# Altium schematic sheet Schemtaic Sheet 4.SchDoc
size A4; SheetNumber: 2; SheetTotal: 3
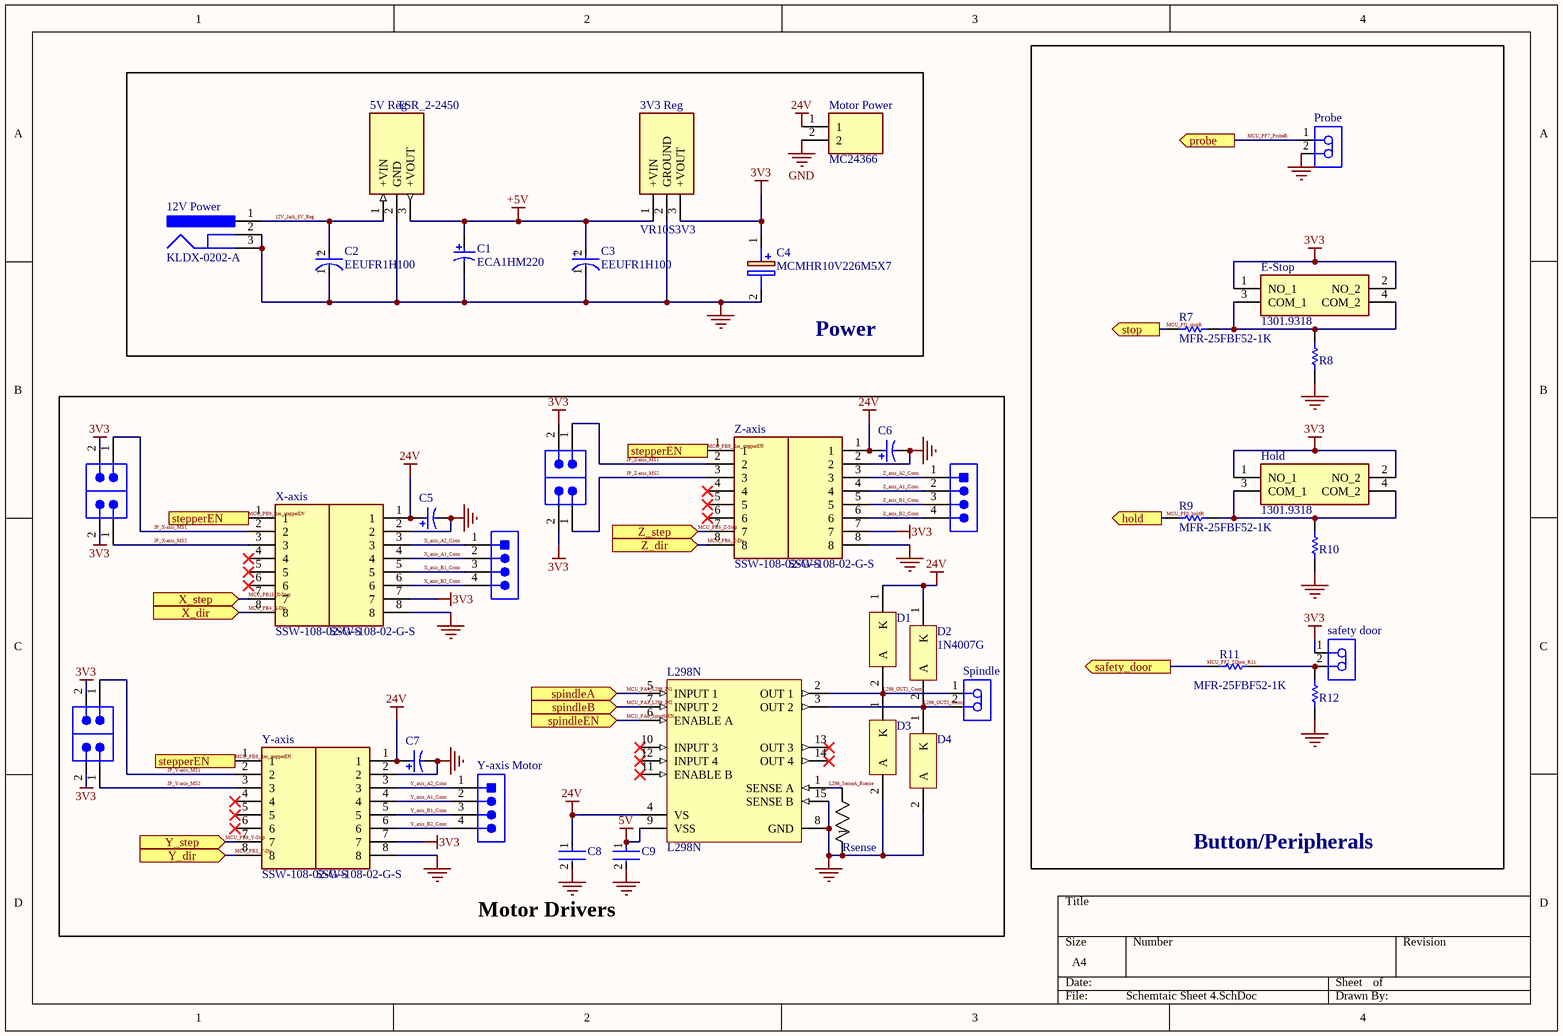
[diagram p0: Schemtaic Sheet 4.SchDoc]

## Parts
3V3_Reg  VR10S3V3  [VR10S3V3]
5V_Reg  TSR_2-2450  [TSR-2]
12V_Power  KLDX-0202-A  [KYCN-KLDX-0202-A_V]
C1  ECA1HM220  [CAPPR55-200-1100X500X1200]
C2  EEUFR1H100  [FP-RAD-TH-D_5_0_5-L_11_1-MFG]
C3  EEUFR1H100  [FP-RAD-TH-D_5_0_5-L_11_1-MFG]
C4  MCMHR10V226M5X7  [CAPPRD200W47D525H800]
C5  ECA1HM101  [CAPPR65-350-1150X800X1250]  (value not drawn)
C6  ECA1HM101  [CAPPR65-350-1150X800X1250]  (value not drawn)
C7  ECA1HM101  [CAPPR65-350-1150X800X1250]  (value not drawn)
C8  K104K15X7RF5TH5  [FP-K15H5-MFG]  (value not drawn)
C9  K104K15X7RF5TH5  [FP-K15H5-MFG]  (value not drawn)
D1  1N4007G  [ONSC-AXIAL_LEAD-2-59-10_P]  (value not drawn)
D2  1N4007G  [ONSC-AXIAL_LEAD-2-59-10_P]
D3  1N4007G  [ONSC-AXIAL_LEAD-2-59-10_P]  (value not drawn)
D4  1N4007G  [ONSC-AXIAL_LEAD-2-59-10_P]  (value not drawn)
E-Stop  1301.9318  [13019318]
Hold  1301.9318  [13019318]
L298N  L298N  [STM-FM-15]
Motor_Power  MC24366  [MC24366]
Probe  B2B-PH-K-S(LF)(SN)  [JST-B2B-PH-K-S_V]  (value not drawn)
R7  MFR-25FBF52-1K  [RESA60-630X240]
R8  MFR-25FBF5210K  [RESA60-630X240]  (value not drawn)
R9  MFR-25FBF52-1K  [RESA60-630X240]
R10  MFR-25FBF5210K  [RESA60-630X240]  (value not drawn)
R11  MFR-25FBF52-1K  [RESA60-630X240]
R12  MFR-25FBF5210K  [RESA60-630X240]  (value not drawn)
Rsense  AC05000001508JAC00  [RES_AC05_VIS]  (value not drawn)
safety_door  B2B-PH-K-S(LF)(SN)  [JST-B2B-PH-K-S_V]  (value not drawn)
Spindle  B2B-PH-K-S(LF)(SN)  [JST-B2B-PH-K-S_V]  (value not drawn)
X-axis  SSW-108-02-G-S  [RHDR8W79P0X254_1X8_2083X241X851P]
X-axis_Header_R  SSW-108-02-G-S  [RHDR8W79P0X254_1X8_2083X241X851P]
X-axis_Motor  B4B-EH-A(LF)(SN)  [JST-B4B-EH-A_V]  (value not drawn)
X-MS1  61300211121  [61300211121]  (value not drawn)
X-MS2  61300211121  [61300211121]  (value not drawn)
Y-axis  SSW-108-02-G-S  [RHDR8W79P0X254_1X8_2083X241X851P]
Y-axis_Header_R  SSW-108-02-G-S  [RHDR8W79P0X254_1X8_2083X241X851P]
Y-axis_Motor  B4B-EH-A(LF)(SN)  [JST-B4B-EH-A_V]  (value not drawn)
Y-MS1  61300211121  [61300211121]  (value not drawn)
Y-MS2  61300211121  [61300211121]  (value not drawn)
Z-axis  SSW-108-02-G-S  [RHDR8W79P0X254_1X8_2083X241X851P]
Z-axis_Header_R  SSW-108-02-G-S  [RHDR8W79P0X254_1X8_2083X241X851P]
Z-axis_Motor  B4B-EH-A(LF)(SN)  [JST-B4B-EH-A_V]  (value not drawn)
Z-MS1  61300211121  [61300211121]  (value not drawn)
Z-MS2  61300211121  [61300211121]  (value not drawn)

## Blocks framed on the sheet
Power: 3V3_Reg 5V_Reg 12V_Power C1-C4 Motor_Power
Button/Peripherals: E-Stop Hold Probe R7-R12 safety_door

## Ports
hold (out, see Schemtaic Sheet 2[2C]), probe (out, see Schemtaic Sheet 2[3C]), safety_door (out, see Schemtaic Sheet 2[2C]), spindleA (in, see Schemtaic Sheet 2[3B]), spindleB (in, see Schemtaic Sheet 2[2B]), spindleEN (in, see Schemtaic Sheet 2[3C]), stepperEN (out, see Schemtaic Sheet 2[4A], Schemtaic Sheet 4[1C]), stepperEN (out, see Schemtaic Sheet 2[4A], Schemtaic Sheet 4[1C], Schemtaic Sheet 4[2B]), stop (out, see Schemtaic Sheet 2[2C]), X_dir (in, see Schemtaic Sheet 2[3B]), X_step (in, see Schemtaic Sheet 2[3A]), Y_dir (in, see Schemtaic Sheet 2[3B]), Y_step (in, see Schemtaic Sheet 2[4A]), Z_dir (in, see Schemtaic Sheet 2[3C]), Z_step (in, see Schemtaic Sheet 2[3B])

## Nets
3V3: 3V3_Reg.3(+VOUT) C4.1(+) E-Stop.1(NO_1) E-Stop.2(NO_2) Hold.1(NO_1) Hold.2(NO_2) safety_door.1 X-axis_Header_R.7 X-MS1.2 X-MS2.2 Y-axis_Header_R.7 Y-MS1.2 Y-MS2.2 Z-axis_Header_R.7 Z-MS1.2 Z-MS2.2
5V: C9.1 L298N.9(VSS)
24V: C5.1 C6.1 C7.1 C8.1 D1.1(K) D2.1(K) L298N.4(VS) Motor_Power.1 X-axis_Header_R.1 Y-axis_Header_R.1 Z-axis_Header_R.1
+5V: 3V3_Reg.1(+VIN) 5V_Reg.3(+VOUT) C1.1 C3.2(A)
GND: 3V3_Reg.2(GROUND) 5V_Reg.2(GND) 12V_Power.2 12V_Power.3 C1.2 C2.1(C) C3.1(C) C4.2(-) C5.2 C6.2 C7.2 C8.2 C9.2 D3.2(A) D4.2(A) L298N.8(GND) L298N.15(SENSE_B) Motor_Power.2 Probe.2 R8.1 R10.1 R12.1 Rsense.1 X-axis_Header_R.2 X-axis_Header_R.8 Y-axis_Header_R.2 Y-axis_Header_R.8 Z-axis_Header_R.2 Z-axis_Header_R.8
12V_Jack_5V_Reg: 5V_Reg.1(+VIN) 12V_Power.1 C2.2(A)
JP_X-axis_MS1: X-axis.2 X-MS1.1
JP_X-axis_MS2: X-axis.3 X-MS2.1
JP_Y-axis_MS1: Y-axis.2 Y-MS1.1
JP_Y-axis_MS2: Y-axis.3 Y-MS2.1
JP_Z-axis_MS1: Z-axis.2 Z-MS1.1
JP_Z-axis_MS2: Z-axis.3 Z-MS2.1
L298_OUT1_Conn: D1.2(A) D3.1(K) L298N.2(OUT_1) Spindle.1
L298_OUT2_Conn: D2.2(A) D4.1(K) L298N.3(OUT_2) Spindle.2
L298_SenseA_Rsense: L298N.1(SENSE_A) Rsense.2
MCU_PA0_SpindleEN: L298N.6(ENABLE_A) ; port spindleEN
MCU_PA3_L298_IN2: L298N.7(INPUT_2) ; port spindleB
MCU_PA4_L298_IN1: L298N.5(INPUT_1) ; port spindleA
MCU_PB3_Y-Dir: Y-axis.8 ; port Y_dir
MCU_PB4_X-Dir: X-axis.8 ; port X_dir
MCU_PB5_Z-Step: Z-axis.7 ; port Z_step
MCU_PB6_Z-Dir: Z-axis.8 ; port Z_dir
MCU_PB8_Y-Step: Y-axis.7 ; port Y_step
MCU_PB9_Res_stepperEN: X-axis.1 Y-axis.1 Z-axis.1 ; port stepperEN
MCU_PB15_X-Step: X-axis.7 ; port X_step
MCU_PF0_holdR: R9.1 ; port hold
MCU_Pf1_stopR: R7.1 ; port stop
MCU_PF2_SDoor_R11: R11.1 ; port safety_door
MCU_PF7_ProbeR: Probe.1 ; port probe
X_axis_A1_Conn: X-axis_Header_R.4 X-axis_Motor.2
X_axis_A2_Conn: X-axis_Header_R.3 X-axis_Motor.1
X_axis_B1_Conn: X-axis_Header_R.5 X-axis_Motor.3
X_axis_B2_Conn: X-axis_Header_R.6 X-axis_Motor.4
Y_axis_A1_Conn: Y-axis_Header_R.4 Y-axis_Motor.2
Y_axis_A2_Conn: Y-axis_Header_R.3 Y-axis_Motor.1
Y_axis_B1_Conn: Y-axis_Header_R.5 Y-axis_Motor.3
Y_axis_B2_Conn: Y-axis_Header_R.6 Y-axis_Motor.4
Z_axis_A1_Conn: Z-axis_Header_R.4 Z-axis_Motor.2
Z_axis_A2_Conn: Z-axis_Header_R.3 Z-axis_Motor.1
Z_axis_B1_Conn: Z-axis_Header_R.5 Z-axis_Motor.3
Z_axis_B2_Conn: Z-axis_Header_R.6 Z-axis_Motor.4
NetE-Stop_3: E-Stop.3(COM_1) E-Stop.4(COM_2) R7.2 R8.2
NetHold_3: Hold.3(COM_1) Hold.4(COM_2) R9.2 R10.2
NetR11_2: R11.2 R12.2 safety_door.2

Not connected (* = marked no-connect by the designer): L298N 10(INPUT_3)* 11(ENABLE_B)* 12(INPUT_4)* 13(OUT_3)* 14(OUT_4)*; X-axis 4* 5* 6*; Y-axis 4* 5* 6*; Z-axis 4* 5* 6*

## Notes on the sheet
- Motor Drivers
- (in symbol CMP-05427-001295-1) +

## Library data of the parts
3V3_Reg = VR10S3V3: Power Supply; Manufacturer_Name: XP POWER; Datasheet Link: https://www.xppower.com/portals/0/pdfs/SF_VR10.pdf; Height: 10.9mm; Manufacturer_Part_Number: VR10S3V3; Mouser Part Number: 209-VR10S3V3; Mouser Price/Stock: https://www.mouser.co.uk/ProductDetail/XP-Power/VR10S3V3?qs=7MVldsJ5UazpqISEyvrTNQ%3D%3D
5V_Reg = TSR_2-2450: Power Supply; Manufacturer_Name: Traco Power; Manufacturer_Part_Number: TSR 2-2450; Datasheet Link: https://tracopower.com/tsr2-datasheet/; Mouser Part Number: 495-TSR2-2450; Mouser Price/Stock: https://www.mouser.co.uk/ProductDetail/TRACO-Power/TSR-2-2450?qs=NtE2QagKf6RzknAolzm%2FTQ%3D%3D; Arrow Part Number: TSR 2-2450; Arrow Price/Stock: https://www.arrow.com/en/products/tsr2-2450/traco-electronic-ag?region=europe
12V_Power = CMP-1673-00001-5: DC Power Jack, 24 V, 3.5 A, -25 to 85 degC, 3-Pin THD, RoHS; Manufacturer: Kycon; Voltage Rating: 24 V; Current Rating: 3.5 A; Height: 10.8 mm; Length: 9.2 mm; Pins: 2; Housing Material: PBT; Connector Type: Power; ComponentLink2URL: http://www.kycon.com/Pub_Eng_Draw/KLDX-0202-X.PDF; PackageDescription: 3-Pin Through Hole Device, Body 14.5 x 9 mm; Max Operating Temperature: 85 degC; Min Operating Temperature: -25 degC; PackageReference: KLDX-0202-A; Contact Gender: Female; Package Quantity: 500; Mount: Through Hole; Colour: Black; Contact Plating: Tin; DatasheetVersion: Rev. D3, 06/2013; ComponentLink2Description: Datasheet; RoHSCompliant: true; Mounting Technology: Through Hole; ComponentLink1Description: Manufacturer URL; Contact Material: Brass; ComponentLink1URL: http://www.kycon.com/
C1 = CMP-1665-00036-2: Aluminum Electrolytic Capacitor, 22 uF, +/- 20%, 50 V, -40 to 85 degC, 2-Pin THD, RoHS, Bulk; Manufacturer: Panasonic; Ripple Current: 100mA; Life (Hours): 2000Hour; Voltage: 50V; Dissipation Factor: 0.12%; Leakage Current: 3uA; Lead/Base Style: Straight; Capacitance: 22uF; Lead Diameter: 0.5mm; Max Operating Temperature: 85degC; Height: 11mm; Package Reference: CAPPR55-200-1100X500X1200; Radiation Hardening: No; RoHSCompliant: true; Termination: Radial; Case/Package: Radial; REACH SVHC: NoSVHC; Height - Seated (Max): 0.472inch; Min Operating Temperature: -40degC; Packaging: Bulk; Manufacturer URL: http://www.panasonic.com/; Length: 11mm; Tolerance: 20%; Voltage Rating: 50V; Voltage Rating (DC): 50V; Datasheet URL: https://industrial.panasonic.com/cdbs/www-data/pdf/RDF0000/ABA0000C1218.pdf; Lead Pitch: 2mm; Ripple Current (AC): 100mA; Package Description: 2-Pin Radial Lead, Dia 5 mm, Height 12 mm; Diameter: 5mm; Datasheet Version: Rev. 05, 10/2016; Package Quantity: 200; Mount: ThroughHole
C2 C3 = CMP-05427-001295-1: Aluminum Electrolytic Capacitors (Radial Lead Type) 10uF ±20% 50V; Lead Diameter: 0.5mm; Life (Hours): 5000Hour; Impedance: 340mR; Ripple Current (AC): 250mA; REACH SVHC: Yes; Tolerance: 20%; Construction: RADIAL; Min Operating Temperature: -40°C; Termination: Radial; Voltage Rating: 50V; Height: 11mm; Max Operating Temperature: 105°C; Capacitance: 10uF; Voltage: 50V; Diameter: 5mm; Lead Pitch: 2mm; Series: FR Radial; RoHS Compliant: Yes; Case/Package: Radial
C4 = MCMHR10V226M5X7: Capacitor Polarised; Manufacturer_Name: Multicomp Pro; Datasheet Link: https://componentsearchengine.com/Datasheets/2/MCMHR10V226M5X7.pdf; Height: 8mm; Manufacturer_Part_Number: MCMHR10V226M5X7
C5-C7 = CMP-1665-00042-2: Aluminum Electrolytic Capacitor, 100 uF, +/- 20%, 50 V, -40 to 85 degC, 2-Pin THD, RoHS, Bulk; Manufacturer: Panasonic; Lead Diameter: 0.6mm; Dielectric Material: Aluminium; Voltage Rating (DC): 50V; Ripple Current (AC): 250mA; Polarity: Polar; Leakage Current: 3uA; Capacitance: 100uF; Life (Hours): 2000Hour; Lead/Base Style: Straight; Dissipation Factor: 0.12%; Radiation Hardening: No; Height: 11.5mm; Package Quantity: 200; Package Reference: CAPPR65-350-1150X800X1250; Min Operating Temperature: -40degC; Mount: ThroughHole; Package Description: 2-Pin Radial Lead, Dia 8 mm, Height 12.5 mm; Case/Package: Radial; Diameter: 8mm; Voltage Rating: 50V; Length: 11.5mm; REACH SVHC: NoSVHC; Height - Seated (Max): 0.492inch; Datasheet URL: https://industrial.panasonic.com/cdbs/www-data/pdf/RDF0000/ABA0000C1218.pdf; RoHSCompliant: true; Ripple Current: 250mA; Lead Free: LeadFree; Voltage: 50V; Manufacturer URL: http://www.panasonic.com/; Number of Pins: 2; Datasheet Version: Rev. 05, 10/2016; Packaging: Bulk; Termination: Radial; Max Operating Temperature: 85degC; Tolerance: 20%; Lead Pitch: 3.5mm
C8 C9 = CMP-02417-000078-1: CAP CER 0.1UF 50V X7R RADIAL; Capacitance: 100nF; Tolerance: 10%; Dielectric Material: Ceramic; Lead Length: 30mm; Lead Diameter: 0.5mm; Lead/Base Style: Formed Leads; Diameter: 500um; Max Operating Temperature: 125°C; Case/Package: Dipped; Dielectric: X7R; Lead Free: Lead Free; Construction: RADIAL; Voltage: 50V; Thickness: 2.6mm; Min Operating Temperature: -55°C; Lead Pitch: 5mm; Height: 4mm; Radiation Hardening: No; Voltage Rating: 50V; Depth: 2.5mm; Voltage Rating (DC): 50V; Package Quantity: 1; Weight: 0.005644oz; Series: K; Mount: Through Hole; Termination: Radial; Height - Seated (Max): 0.257inch; Length: 4mm; Packaging: Tape and Reel; Width: 2.5mm; RoHS Compliant: Yes
D1-D4 = CMP-0902-00143-1: Standard Recovery Rectifier, 2-Pin Axial_Lead, Pb-Free, Bulk Bag; Manufacturer: On Semiconductor; VRRM Max (V): 1000; IFSM Max (A): 30; IO(rec) Max (A): 1; ComponentLink2Description: Datasheet; ComponentLink2URL: http://www.onsemi.com/pub_link/Collateral/1N4001-D.PDF; PackageDescription: 2-Pin, Axial Lead, Diameter 2.35 mm; PartNumber: 1N4007G; ComponentLink1URL: http://www.onsemi.com/; ComponentLink3URL: http://www.onsemi.cn/pub_link/Collateral/59-10.PDF; PackageReference: AXIAL_LEAD-2-59-10; ComponentLink1Description: Manufacturer URL; Mounting Technology: Through Hole; ComponentLink3Description: Package Specification; Packing: Bulk Bag; PackageVersion: Rev. U, 02/2005; DatasheetVersion: Rev. 13; RoHS: TRUE; Type: Standard Recovery
E-Stop Hold = 1301.9318: IP40 Black Button Tactile Switch, SPST-NO 4.4mm; Manufacturer_Name: SCHURTER; Geometry.Height: 8mm; Manufacturer_Part_Number: 1301.9318; Mouser Part Number: 693-1301.9318; Mouser Price/Stock: https://www.mouser.co.uk/ProductDetail/Schurter/13019318?qs=tGaZrb6HVSaxYojxkk2y5w%3D%3D; Arrow Part Number: *; Arrow Price/Stock: *; Datasheet Link: https://componentsearchengine.com/Datasheets/2/1301.9318.pdf
L298N = CMP-2000-06526-1: Dual Full-Bridge Driver, 4.8 to 46 V, -40 to 150 degC, 15-Pin FM (MW 15L), RoHS, Tube; Manufacturer: STMicroelectronics; PartNumber: L298; Output Current: 2A; Supply Voltage Max: 7V; Driver Case Style: Multiwatt; Supply Voltage Min: 4.5V; No. of Pins: 15Pins; SVHC: NoSVHC(17-Dec-2015); Output Voltage: 46V; No. of Outputs: 4Outputs; Motor Type: FullBridge; MSL: -; Package Description: 15-Pin Flange Mount, Body 5 x 19.6 mm, Pitch 1.27 mm; Datasheet Version: 01/2000; Package Reference: FM-15; Mounting Technology: ThroughHole; Packaging: Each; Automotive Qualification Standard: -; Product Range: -; Datasheet URL: https://datasheet.ciiva.com/15109/getdatasheetpartid-50682-15109332.pdf; Operating Temperature Max: 130°C; Operating Temperature Min: -25°C; Manufacturer URL: http://www.st.com/
Motor_Power = MC24366: TERMINAL BLOCK, WIRE TO BRD, 2POS, 12AWG; Manufacturer_Name: MULTICOMP; Geometry.Height: 14.3mm; Manufacturer_Part_Number: MC24366; Mouser Part Number: *; Mouser Price/Stock: *; Arrow Part Number: *; Arrow Price/Stock: *; Datasheet Link: *
Probe safety_door Spindle = CMP-2000-05162-1: Male Header, Pitch 2 mm, 1 x 2 Position, Height 6 mm, Tail Length 3.4 mm, -25 to 85 degC, RoHS, Bulk; Manufacturer: JST; Pitch: 2mm; Style/Orientation: StraightHeader/Plug; No of Positions: 2; Datasheet Version: Nov-08; Datasheet URL: http://datasheet.octopart.com/B2B-PH-K-S%28LF%29%28SN%29-JST-datasheet-8324864.pdf; Manufacturer URL: http://www.jst.com/home2.html; Type: ShroudedHeader; Termination: Crimp
R7 R9 R11 = CMP-1659-00075-1: Axial Resistor, 1 KOhm, +/- 1%, 250 mW, -55 to 155 degC, 2-Pin THD, RoHS, Bulk; Voltage Rating: 250 V; Resistance: 10 kohm; Power Rating: 250 mW; ComponentLink2Description: Datasheet; RoHSCompliant: true; PackageReference: MFR-25; Case\Package: Axial; Max Operating Temperature: 155 degC; DatasheetVersion: Apr-13; Tolerance: 1%; ComponentLink1URL: http://www.yageo.com/; Length: 0.248 inch; ComponentLink2URL: http://www.yageo.com/documents/recent/Yageo%20LR_MFR_2013.pdf; Packaging: Bulk; Package Quantity: 200; PackageDescription: 2-Pin Axial Lead, Dia 2.4 mm, Body Length 6.3 mm; Min Operating Temperature: -55 degC; ComponentLink1Description: Manufacturer URL
R8 R10 R12 = CMP-1659-00074-2: Axial Resistor, 10 KOhm, +/- 1%, 0.25 W, -55 to 155 degC, 2-Pin THD, RoHS, Bulk; Manufacturer: Yageo; Temperature Coefficient: 100ppm\/degreesC; Voltage Rating: 250V; Voltage Rating (DC): 200V; Resistance: 10KOhm; Max Power Dissipation: 250mW; Datasheet URL: http://www.yageo.com/documents/recent/Yageo%20LR_MFR_2013.pdf; Packaging: Bulk; RoHSCompliant: True; Mount: ThroughHole; Package Reference: MFR-25; Termination: Axial; Composition: MetalFilm; Number of Terminations: 2; Package Quantity: 200; Mounting Technology: ThroughHole; Length: 0.248inch; Max Operating Temperature: 155degC; Min Operating Temperature: -55degC; Datasheet Version: 04/2013; Lead Free: LeadFree; Manufacturer URL: http://www.yageo.com/; Tolerance: 1%; Power Rating: 250mW; Package Description: 2-Pin Axial Lead, Dia 2.4 mm, Body Length 6.3 mm; Military Standard: Not; Case\/Package: Axial
Rsense = CMP-00030-39746773-1: AC05000001508JAC00 Resistor, 1.5 Ohm, ± 5%, 5 W, Axial Leaded, Wirewound, General Purpose; Voltage Rating: 3V; Power Rating: 5W; Resistance: 1.5Ω; Lead Diameter: 800µm; Temperature Coefficient: -80ppm/°C; RoHS: Compliant; Weight: 1.900013g; Voltage Rating (DC): 3V; Max Operating Temperature: 275°C; NexarPartId: 39746773; Features: Flame Retardant Coating; Number of Pins: 2; REACH SVHC: Unknown; Contact Plating: Tin; Min Operating Temperature: -40°C; Width: 7.493mm; Radiation Hardening: No; Number of Terminations: 2; Diameter: 7.5mm; Termination: Axial; Composition: Wirewound; Max Power Dissipation: 5W; Packaging: Tape & Box (TB); Length: 18mm; Tolerance: 5%; Case/Package: Axial; Military Standard: Not
X-axis X-axis_Header_R Y-axis Y-axis_Header_R Z-axis Z-axis_Header_R = SSW-108-02-G-S: Connector; Manufacturer_Name: SAMTEC; Datasheet Link: https://componentsearchengine.com/Datasheets/1/SSW-108-02-G-S-LL.pdf; Height: 8.51mm; Manufacturer_Part_Number: SSW-108-02-G-S; Mouser Part Number: 200-SSW10802GS; Mouser Price/Stock: https://www.mouser.co.uk/ProductDetail/Samtec/SSW-108-02-G-S?qs=rU5fayqh%252BE1JXJ1Fey24nA%3D%3D; Arrow Part Number: SSW-108-02-G-S; Arrow Price/Stock: https://www.arrow.com/en/products/ssw-108-02-g-s/samtec?region=nac
X-axis_Motor Y-axis_Motor Z-axis_Motor = CMP-2000-05904-1: Male Header, Pitch 2.5 mm, 1 x 4 Position, Height 6 mm, Tail Length 3.2 mm, -25 to 85 degC, RoHS, Bulk; Manufacturer: JST; Style/Orientation: StraightHeader/Plug; Pitch: 2.5mm; No of Positions: 4; Mounting Technology: SurfaceMount; Package Description: Male Header, Pitch 2.5 mm, 1 x 4 Position, Height 6 mm, Tail Length 3.2 mm; Datasheet Version: 12/2012; Type: ShroudedHeader; Package Reference: B4B-EH-A; Manufacturer URL: http://www.jst.com/home2.html; Termination: Crimp; Datasheet URL: http://www.jst-mfg.com/product/pdf/eng/eEH.pdf
X-MS1 X-MS2 Y-MS1 Y-MS2 Z-MS1 Z-MS2 = CMP-1712-00002-5: NexarPartId: 20081794; Operating Supply Voltage: 250V; Current Rating: 3A; Gender: Male; Number of Contacts: 2; Pitch: 2.54mm; Connector Type: Male Pin; Contact Resistance: 20mΩ; Contact Plating: Gold; Contact Material: Copper; Number of Pins: 2; Min Operating Temperature: -40°C; Packaging: Bulk; Lead Pitch: 2.54mm; Mount: Through Hole; Orientation: Vertical; RoHS: Compliant; REACH SVHC: No SVHC; Height: 8.94mm; Termination: Through Hole; Number of Positions: 2; Contact Mating Length: 5.9944mm; Color: Black; Contact Gender: Male; Number of Rows: 1; Housing Material: PBT; Lead Free: Lead Free; Voltage Rating: 250V; Max Operating Temperature: 125°C